# EAGLE board EurocardBackplane (EAGLE 6.6.0)
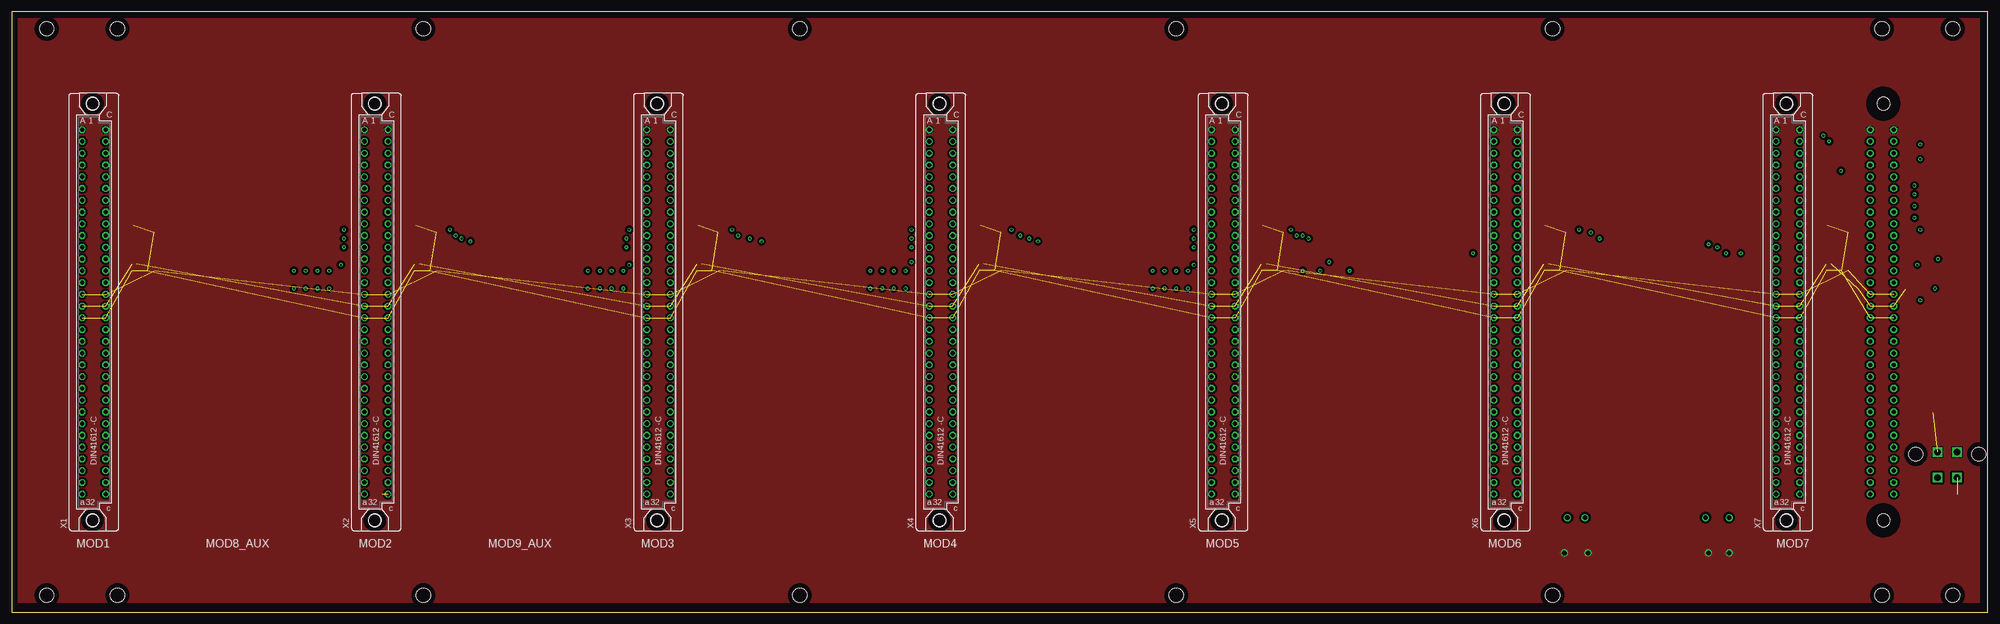
[diagram p8: board, top side]
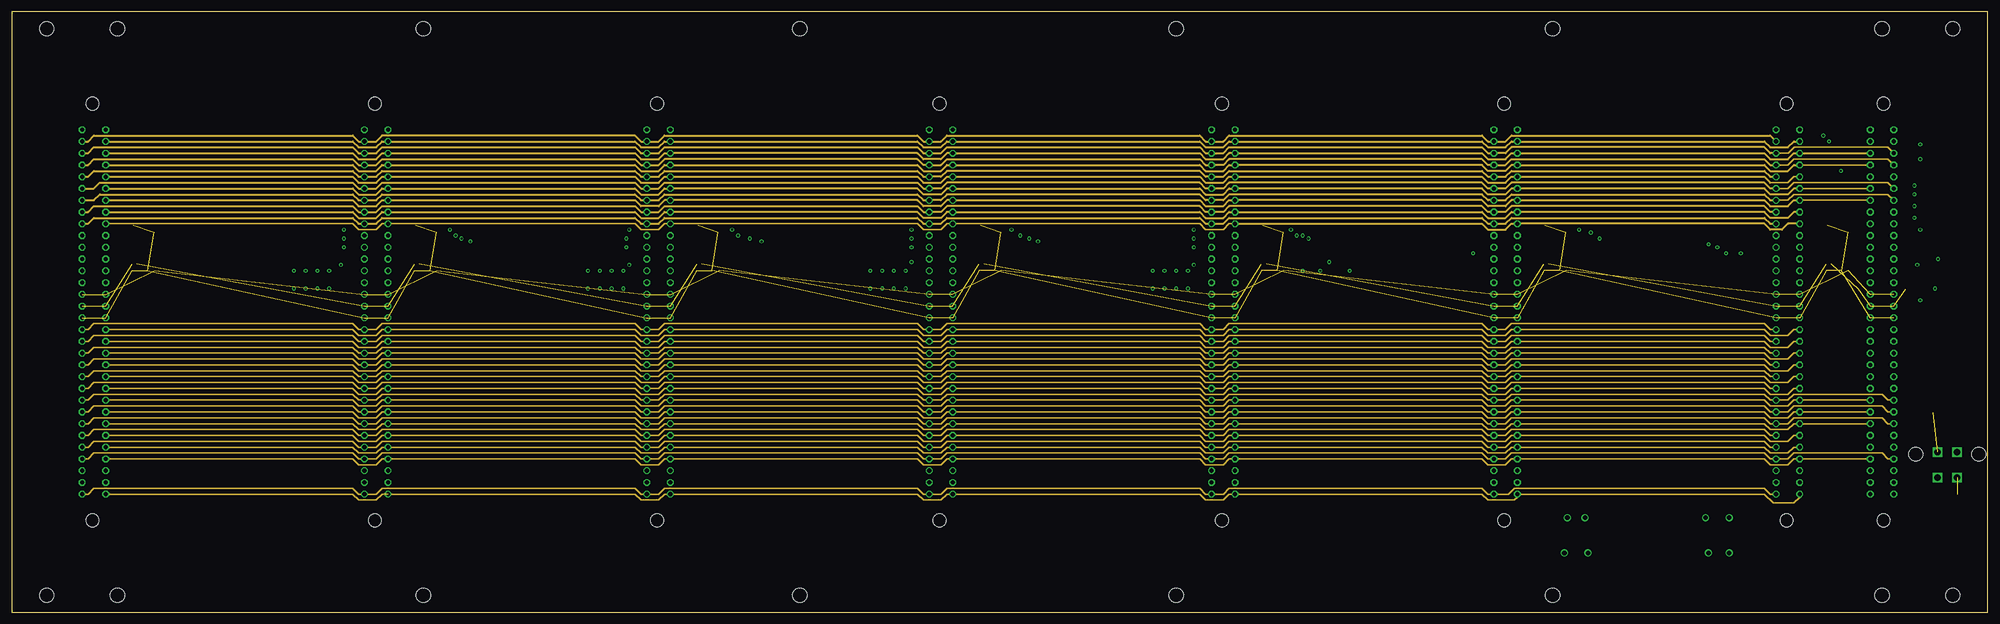
[diagram p9: board, inner layer Route2]
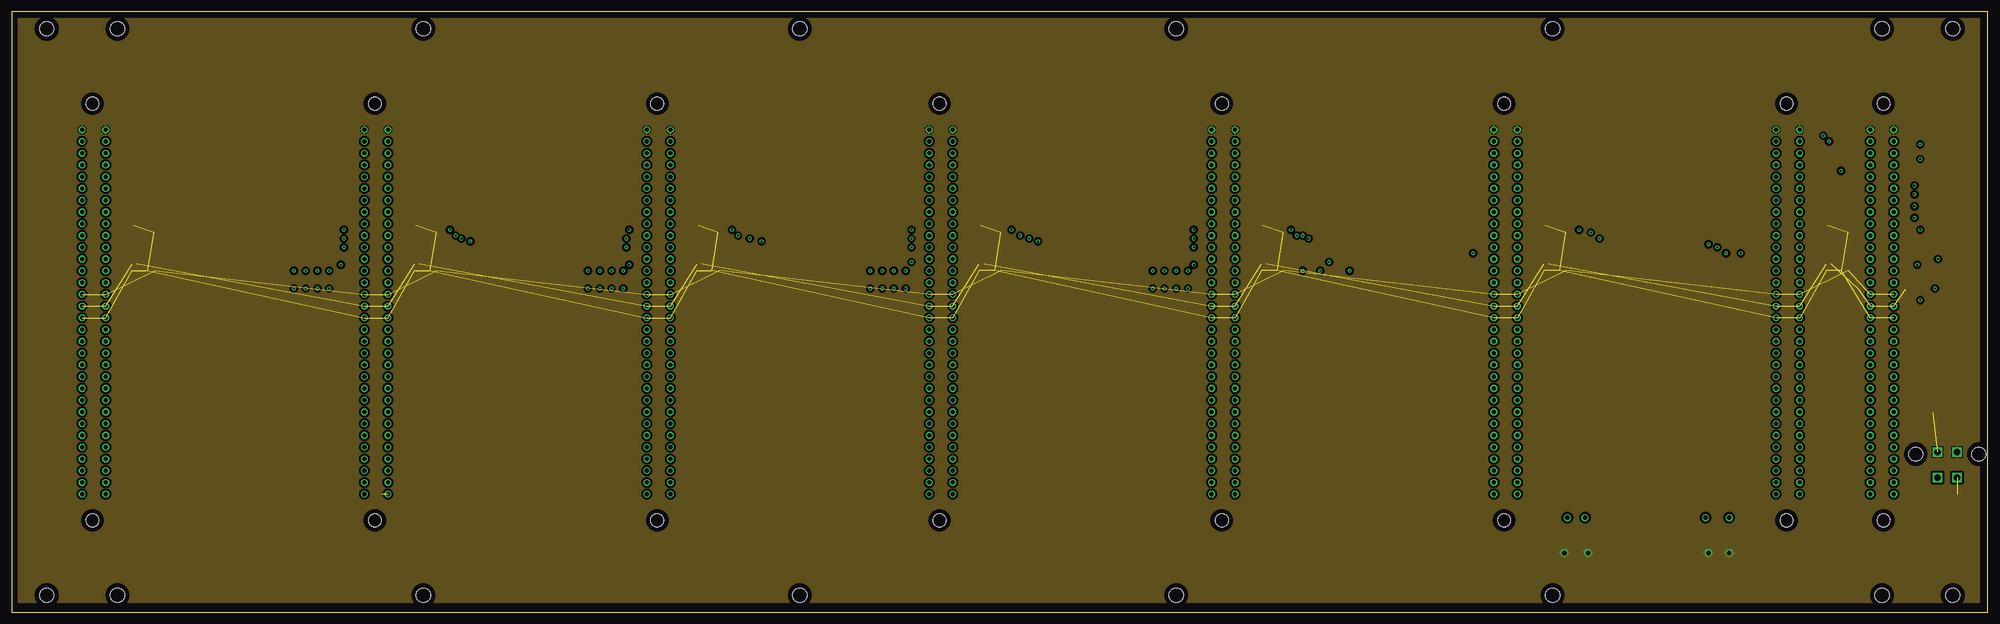
[diagram p10: board, inner layer Route3]
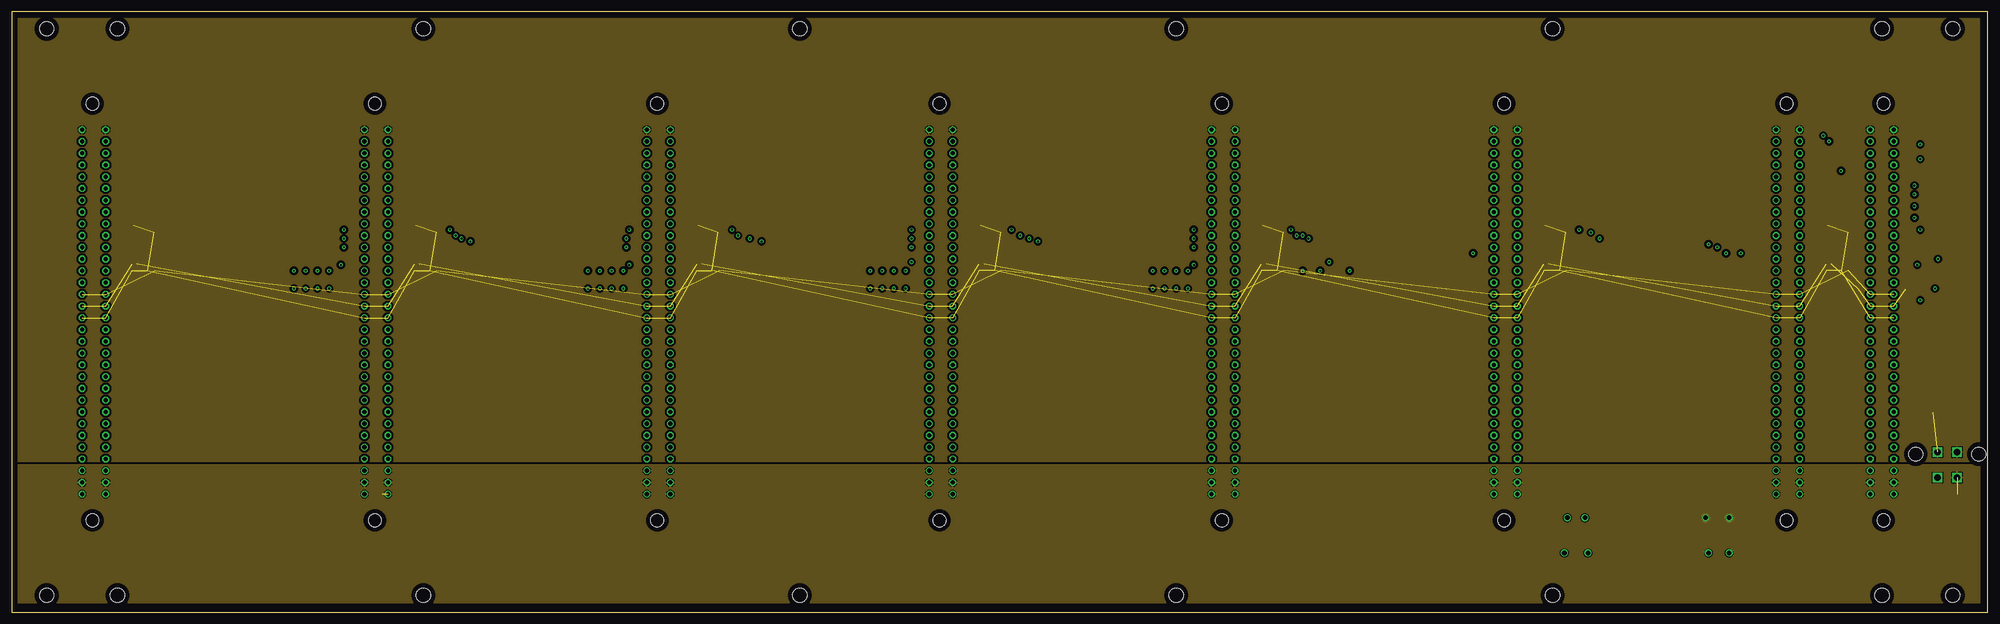
[diagram p11: board, inner layer Route14]
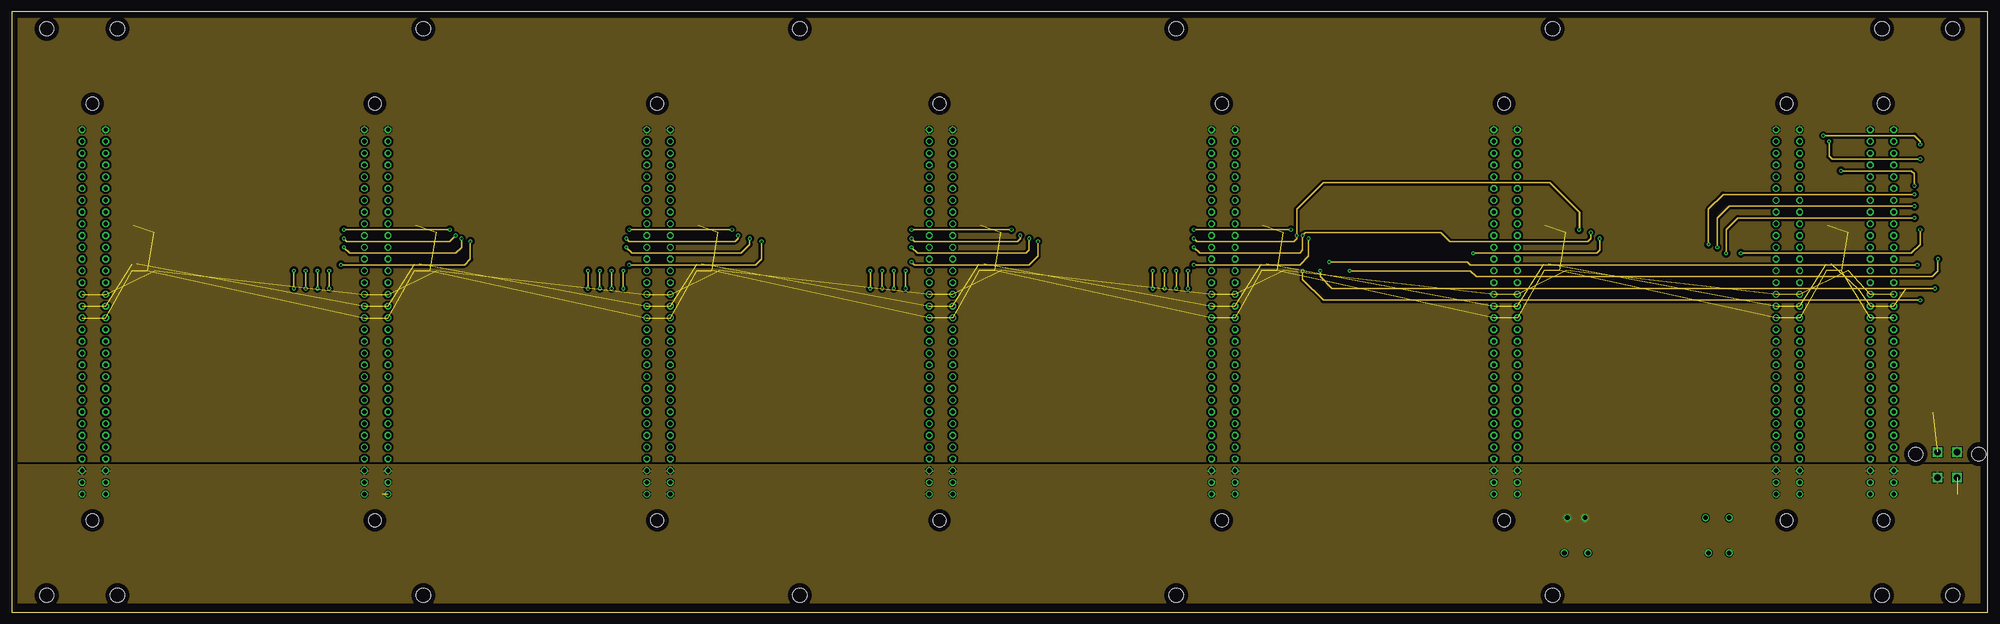
[diagram p12: board, inner layer Route15]
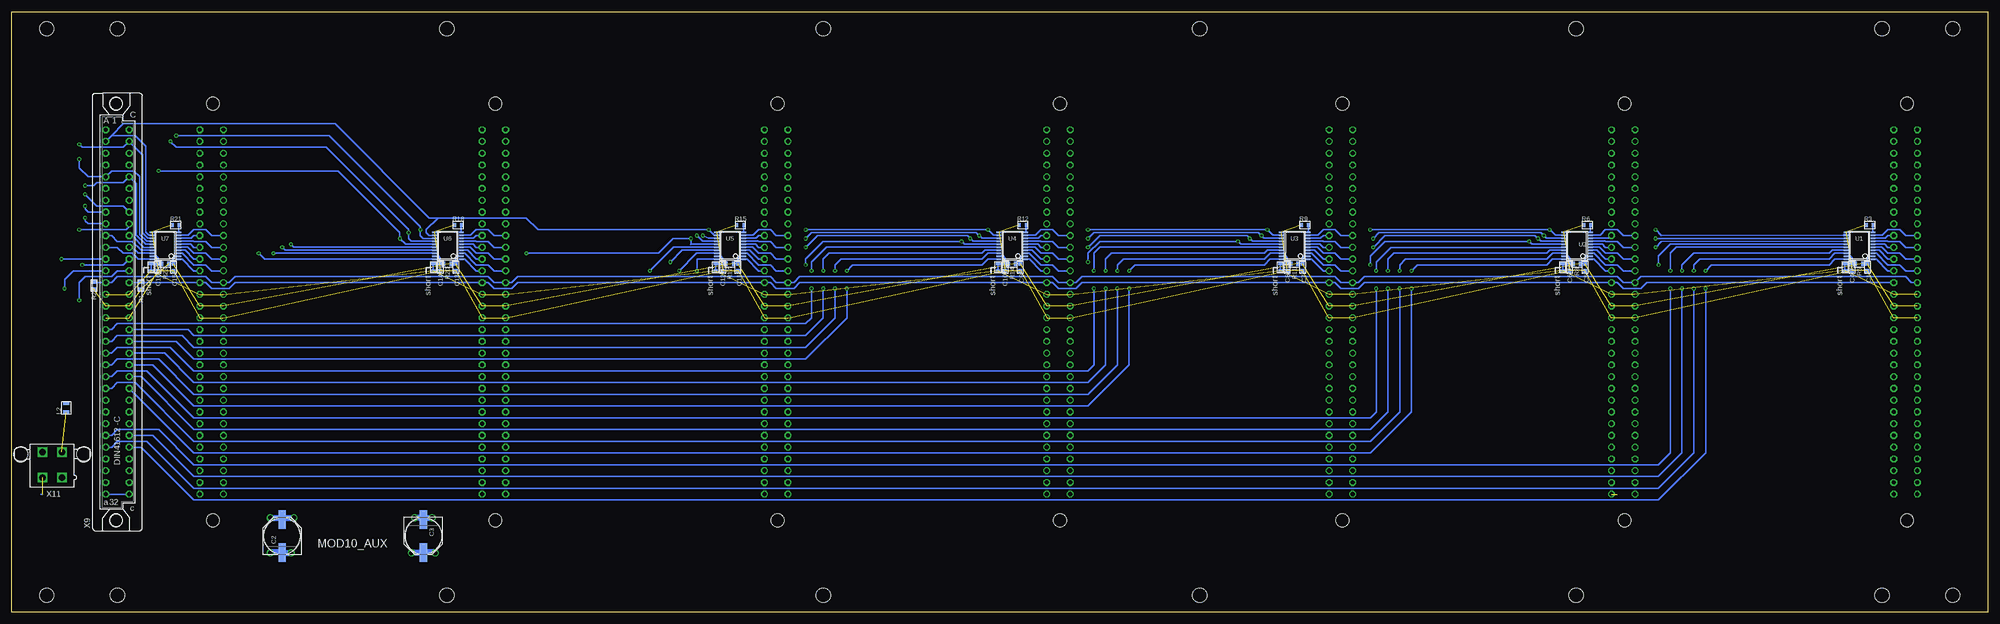
[diagram p13: board, bottom side, seen from below]

Size 426.72 x 129.79 mm. Coordinates in mm from the lower left corner, seen from the top.
Copper layers (1*2*3*14*15*16): Top 0.035mm / dielectric 1.5mm / Route2 0.035mm / dielectric 0.15mm / Route3 0.035mm / dielectric 0.2mm / Route14 0.035mm / dielectric 0.15mm / Route15 0.035mm / dielectric 0.2mm / Bottom 0.035mm
Design rules "default *": minimum track width 10mil, minimum drill 15mil, track to track 8mil, track to pad 8mil, pad to pad 8mil, via to via 8mil, smd to smd 8mil, copper to edge 40mil, drill to drill 8mil, minimum pad ring 10mil, minimum via ring 8mil, stop-mask expansion 4mil, vias tented up to drill 0mil, thermal gap 10mil

## Footprints (pad centres in the part's own frame; a part is rotated, then mirrored left to right if it is on the bottom)
C_MLCC_0603 = smd 0.8 x 0.8: P$1 -0.75,0; P$2 0.75,0
PANASONIC_F = smd 4 x 1.6: + 3.55,0; - -3.55,0
R_0805 = smd 0.7 x 1.3: P$1 -0.95,0; P$2 0.95,0
R_0603 = smd 0.6 x 0.9: P$1 -0.75,0; P$2 0.75,0
TSSOP20 = smd 0.305 x 0.991: 1 -2.575,-2.728; 2 -1.925,-2.728; 3 -1.275,-2.728; 4 -0.625,-2.728; 5 0.025,-2.728; 6 0.675,-2.728; 7 1.325,-2.728; 8 1.975,-2.728; 9 2.625,-2.728; 10 3.275,-2.728; 11 3.275,3.108; 12 2.625,3.108; 13 1.975,3.108; 14 1.325,3.108; 15 0.675,3.108; 16 0.025,3.108; 17 -0.625,3.108; 18 -1.275,3.108; 19 -1.925,3.108; 20 -2.575,3.108
BACKPLANE = hole 3.099: 7.62,126.111; 22.86,126.111; 88.9,126.111; 170.18,126.111; 251.46,126.111; 332.74,126.111; 419.1,126.111; 403.86,126.111; 7.62,3.683; 22.86,3.683; 88.9,3.683; 170.18,3.683; 251.46,3.683; 332.74,3.683; 419.1,3.683; 403.86,3.683
FAC64S = drill 0.914 octagon: A1 -2.54,39.37; A2 -2.54,36.83; A3 -2.54,34.29; A4 -2.54,31.75; A5 -2.54,29.21; A6 -2.54,26.67; A7 -2.54,24.13; A8 -2.54,21.59; A9 -2.54,19.05; A10 -2.54,16.51; A11 -2.54,13.97; A12 -2.54,11.43; A13 -2.54,8.89; A14 -2.54,6.35; A15 -2.54,3.81; A16 -2.54,1.27; A17 -2.54,-1.27; A18 -2.54,-3.81; A19 -2.54,-6.35; A20 -2.54,-8.89; A21 -2.54,-11.43; A22 -2.54,-13.97; A23 -2.54,-16.51; A24 -2.54,-19.05; A25 -2.54,-21.59; A26 -2.54,-24.13; A27 -2.54,-26.67; A28 -2.54,-29.21; A29 -2.54,-31.75; A30 -2.54,-34.29; A31 -2.54,-36.83; A32 -2.54,-39.37; C1 2.54,39.37; C2 2.54,36.83; C3 2.54,34.29; C4 2.54,31.75; C5 2.54,29.21; C6 2.54,26.67; C7 2.54,24.13; C8 2.54,21.59; C9 2.54,19.05; C10 2.54,16.51; C11 2.54,13.97; C12 2.54,11.43; C13 2.54,8.89; C14 2.54,6.35; C15 2.54,3.81; C16 2.54,1.27; C17 2.54,-1.27; C18 2.54,-3.81; C19 2.54,-6.35; C20 2.54,-8.89; C21 2.54,-11.43; C22 2.54,-13.97; C23 2.54,-16.51; C24 2.54,-19.05; C25 2.54,-21.59; C26 2.54,-24.13; C27 2.54,-26.67; C28 2.54,-29.21; C29 2.54,-31.75; C30 2.54,-34.29; C31 2.54,-36.83; C32 2.54,-39.37 | hole 2.794: -0.305,45.009; -0.305,-45.009
5566-4 = drill 1.4 square: 1 2.1,-2.75; 2 -2.1,-2.75; 3 2.1,2.75; 4 -2.1,2.75 | hole 3: 6.8,2.29; -6.8,2.29

## Placement (x,y rotation side)
C1  [C_MLCC_0603]  26.04,74.55 270 bottom
C2  220uF  [PANASONIC_F]  368.3,16.51 90 bottom
C3  [PANASONIC_F]  337.82,16.51 270 bottom
C4  [C_MLCC_0603]  29.34,74.55 270 bottom
C5  [C_MLCC_0603]  87,74.55 270 bottom
C6  [C_MLCC_0603]  90.3,74.55 270 bottom
C7  [C_MLCC_0603]  147.96,74.55 270 bottom
C8  [C_MLCC_0603]  151.26,74.55 270 bottom
C9  [C_MLCC_0603]  208.91,74.55 270 bottom
C10  [C_MLCC_0603]  212.22,74.55 270 bottom
C11  [C_MLCC_0603]  269.88,74.55 270 bottom
C12  [C_MLCC_0603]  273.18,74.55 270 bottom
C13  [C_MLCC_0603]  330.83,74.55 270 bottom
C14  [C_MLCC_0603]  334.14,74.55 270 bottom
C15  [C_MLCC_0603]  391.8,74.55 270 bottom
C16  [C_MLCC_0603]  395.1,74.55 270 bottom
L2  [R_0805]  414.91,44.2 90 bottom
R1  4k7  [R_0603]  398.78,70.61 270 bottom
R2  4k7  [R_0603]  408.94,70.61 270 bottom
R3  10k  [R_0603]  25.53,83.69 0 bottom
R4  [R_0603]  30.86,74.55 270 bottom
R5  [R_0603]  27.81,75.31 0 bottom
R6  10k  [R_0603]  86.49,83.69 0 bottom
R7  [R_0603]  91.82,74.55 270 bottom
R8  [R_0603]  88.77,75.31 0 bottom
R9  10k  [R_0603]  147.45,83.69 0 bottom
R10  [R_0603]  152.78,74.55 270 bottom
R11  [R_0603]  149.73,75.31 0 bottom
R12  10k  [R_0603]  208.41,83.69 0 bottom
R13  [R_0603]  213.74,74.55 270 bottom
R14  [R_0603]  210.69,75.31 0 bottom
R15  10k  [R_0603]  269.37,83.69 0 bottom
R16  [R_0603]  274.7,74.55 270 bottom
R17  [R_0603]  271.65,75.31 0 bottom
R18  10k  [R_0603]  330.33,83.69 0 bottom
R19  [R_0603]  335.66,74.55 270 bottom
R20  [R_0603]  332.61,75.31 0 bottom
R21  10k  [R_0603]  391.29,83.69 0 bottom
R22  [R_0603]  396.62,74.55 270 bottom
R23  [R_0603]  393.57,75.31 0 bottom
U1  TXB0108  [TSSOP20]  27.56,78.87 90 bottom
U2  TXB0108  [TSSOP20]  88.52,78.87 90 bottom
U3  TXB0108  [TSSOP20]  149.48,78.87 90 bottom
U4  TXB0108  [TSSOP20]  210.44,78.87 90 bottom
U5  TXB0108  [TSSOP20]  271.4,78.87 90 bottom
U6  TXB0108  [TSSOP20]  332.36,78.87 90 bottom
U7  TXB0108  [TSSOP20]  393.32,78.87 90 bottom
U$1  [JQI_LOGO_NEGATIVE-SILKSCREEN]  322.58,137.16 0 top  (outside the outline)
U$3  [BACKPLANE]  0,0 0 top
U$4  [JQI_LOGO_NEGATIVE-SILKSCREEN]  353.06,137.16 0 bottom  (outside the outline)
X1  FAC64S  [FAC64S]  17.78,64.9 0 top
X2  FAC64S  [FAC64S]  78.74,64.9 0 top
X3  FAC64S  [FAC64S]  139.7,64.9 0 top
X4  FAC64S  [FAC64S]  200.66,64.9 0 top
X5  FAC64S  [FAC64S]  261.62,64.9 0 top
X6  FAC64S  [FAC64S]  322.58,64.9 0 top
X7  FAC64S  [FAC64S]  383.54,64.9 0 top
X9  FAC64S  [FAC64S]  403.86,64.9 0 bottom
X11  [5566-4]  417.96,31.88 0 bottom

## Tracks (layer width: path | path; a pad name or v marks a point on that pad's centre or on a via)
3V3  (24 unrouted)
  Bottom 0.305: U1.2 25.67,76.94 26.04,76.58 C1.P$1 26.05,75.31 R5.P$2 | U2.2 86.63,76.94 87,76.58 C5.P$1 87.01,75.31 R8.P$2 | U3.2 147.59,76.94 147.96,76.58 C7.P$1 147.97,75.31 R11.P$2 | U4.2 208.55,76.94 208.91,76.58 C9.P$1 208.93,75.31 R14.P$2 | U5.2 269.51,76.94 269.88,76.58 C11.P$1 269.89,75.31 R17.P$2 | U6.2 330.47,76.94 330.83,76.58 C13.P$1 330.85,75.31 R20.P$2 | U7.2 391.43,76.94 391.8,76.58 C15.P$1 391.81,75.31 R23.P$2
5V  (22 unrouted)
  Bottom 0.305: R4.P$2 30.86,75.31 | R10.P$2 152.78,75.31 | R13.P$2 213.74,75.31 | R16.P$2 274.7,75.31 | R19.P$2 335.66,75.31 | R22.P$2 396.62,75.31
+15V  (via drill 1)  (1 unrouted)
  Bottom 0.305: 420.37,25.53 420.06,25.53
  Bottom 1.27: C2.+ 367.91,20.45 v365.76,20.45 | v370.84,20.45 368.3,20.45
  pour Route14: 424.18,31.88 424.81,31.88 424.81,2.03 1.27,2.03 1.27,31.88
-15V  (via drill 1)
  Bottom 1.27: v339.73,20.45 338.21,20.45 arc90 C3.- 337.43,20.45 v335.92,20.45
  pour Route15: 424.18,31.88 424.81,31.88 424.81,2.03 1.27,2.03 1.27,31.88
A2
  Route2 0.406: X1.A2 16.51,101.73 17.78,103 73.66,103 74.93,101.73 X2.A2 78.74,101.73 80.01,103 134.62,103 135.89,101.73 X3.A2 139.7,101.73 140.97,103 195.58,103 196.85,101.73 X4.A2 200.66,101.73 201.93,103 256.54,103 257.81,101.73 X5.A2 261.62,101.73 262.89,103 317.5,103 318.77,101.73 X6.A2 322.58,101.73 323.85,103 379.73,103 X7.A2
A3
  Route2 0.305: X7.A3 383.67,99.19 384.94,100.46 405.13,100.46 X9.A3
  Route2 0.406: X1.A3 16.51,99.19 17.78,100.46 73.66,100.46 74.93,99.19 X2.A3 78.74,99.19 80.01,100.46 134.62,100.46 135.89,99.19 X3.A3 139.7,99.19 140.97,100.46 195.58,100.46 196.85,99.19 X4.A3 200.66,99.19 201.93,100.46 256.54,100.46 257.81,99.19 X5.A3 261.62,99.19 262.89,100.46 317.5,100.46 318.77,99.19 X6.A3 322.58,99.19 323.85,100.46 378.46,100.46 379.73,99.19 X7.A3
A4
  Route2 0.305: X7.A4 383.54,96.65 384.81,97.92 405.13,97.92 X9.A4
  Route2 0.406: X1.A4 16.51,96.65 17.78,97.92 73.66,97.92 74.93,96.65 X2.A4 78.74,96.65 80.01,97.92 134.62,97.92 135.89,96.65 X3.A4 139.7,96.65 140.97,97.92 195.58,97.92 196.85,96.65 X4.A4 200.66,96.65 201.93,97.92 256.54,97.92 257.81,96.65 X5.A4 261.62,96.65 262.89,97.92 317.5,97.92 318.77,96.65 X6.A4 322.58,96.65 323.85,97.92 378.46,97.92 379.73,96.65 X7.A4
A5
  Route2 0.406: X1.A5 16.51,94.11 17.78,95.38 73.66,95.38 74.93,94.11 X2.A5 78.74,94.11 80.01,95.38 134.62,95.38 135.89,94.11 X3.A5 139.7,94.11 140.97,95.38 195.58,95.38 196.85,94.11 X4.A5 200.66,94.11 201.93,95.38 256.54,95.38 257.81,94.11 X5.A5 261.62,94.11 262.89,95.38 317.5,95.38 318.77,94.11 X6.A5 322.58,94.11 323.85,95.38 378.46,95.38 379.73,94.11 X7.A5
A6
  Route2 0.305: X7.A6 383.54,91.57 384.81,92.84 405.13,92.84 X9.A6
  Route2 0.406: X1.A6 17.78,91.57 19.05,92.84 73.66,92.84 74.93,91.57 X2.A6 78.74,91.57 80.01,92.84 134.62,92.84 135.89,91.57 X3.A6 139.7,91.57 140.97,92.84 195.58,92.84 196.85,91.57 X4.A6 200.66,91.57 201.93,92.84 256.54,92.84 257.81,91.57 X5.A6 261.62,91.57 262.89,92.84 317.5,92.84 318.77,91.57 X6.A6 322.58,91.57 323.85,92.84 378.46,92.84 379.73,91.57 X7.A6
A7
  Route2 0.305: X7.A7 383.54,89.03 384.81,90.3 405.13,90.3 X9.A7
  Route2 0.406: X1.A7 17.78,89.03 19.05,90.3 73.66,90.3 74.93,89.03 X2.A7 78.74,89.03 80.01,90.3 134.62,90.3 135.89,89.03 X3.A7 139.7,89.03 140.97,90.3 195.58,90.3 196.85,89.03 X4.A7 200.66,89.03 201.93,90.3 256.54,90.3 257.81,89.03 X5.A7 261.62,89.03 262.89,90.3 317.5,90.3 318.77,89.03 X6.A7 322.58,89.03 323.85,90.3 378.46,90.3 379.73,89.03 X7.A7
A8
  Route2 0.406: X1.A8 16.51,86.49 17.78,87.76 73.66,87.76 74.93,86.49 X2.A8 78.74,86.49 80.01,87.76 134.62,87.76 135.89,86.49 X3.A8 139.7,86.49 140.97,87.76 195.58,87.76 196.85,86.49 X4.A8 200.66,86.49 201.93,87.76 256.54,87.76 257.81,86.49 X5.A8 261.62,86.49 262.89,87.76 317.5,87.76 318.77,86.49 X6.A8 322.58,86.49 323.85,87.76 378.46,87.76 379.73,86.49 X7.A8
A9
  Route2 0.406: X1.A9 16.51,83.95 17.78,85.22 73.66,85.22 74.93,83.95 X2.A9 78.74,83.95 80.01,85.22 134.62,85.22 135.89,83.95 X3.A9 139.7,83.95 140.97,85.22 195.58,85.22 196.85,83.95 X4.A9 200.66,83.95 201.93,85.22 256.54,85.22 257.81,83.95 X5.A9 261.62,83.95 262.89,85.22 317.5,85.22 318.77,83.95 X6.A9 322.58,83.95 323.85,85.22 378.46,85.22 379.73,83.95 X7.A9
A10  (via drill 0.38)
  Route15 0.305: v71.75,82.68 v94.61,82.68 | v133.35,82.68 v155.57,82.68 | v194.31,82.68 v215.9,82.68 | v255.27,82.68 v276.23,82.68
  Bottom 0.305: U7.12 397.09,81.49 397.76,82.17 397.76,100.71 400.05,103 405.13,103 | 31.2,81.49 70.48,81.41 v71.75,82.68 | v133.35,82.68 v94.61,82.68 93.43,81.49 U2.12 | v194.31,82.68 v155.57,82.68 154.39,81.49 U3.12 | v255.27,82.68 v215.9,82.68 214.72,81.49 U4.12 | U5.12 275.04,81.49 v276.23,82.68 313.06,82.68 315.6,85.22 334.64,85.22 | 405.13,103 402.59,105.54 356.87,105.54 336.55,85.22 334.64,85.22 | 405.13,103 X9.A2 | 334.64,85.22 337.19,82.68 337.19,82.04 336.55,81.41 335.55,81.41 U6.12
  Bottom 0.406: U1.12 31.2,81.49
A11  (via drill 0.38)
  Route15 0.305: v71.75,78.87 73.03,77.6 95.89,77.6 97.16,78.87 v97.16,80.77 | v132.72,78.87 133.99,77.6 157.48,77.6 159.38,79.5 v159.38,80.77 | v194.31,78.87 195.58,77.6 219.07,77.6 219.71,78.23 v219.71,80.77 | v255.27,78.87 256.54,77.6 278.13,77.6 278.76,78.23 v278.76,81.41 279.4,82.04 308.61,82.04 310.51,80.14 340.36,80.14 341,80.77 v341,82.04 | v412.12,97.92 393.06,97.92 392.43,98.55 v392.43,101.73
  Bottom 0.305: U7.14 397.56,80.19 399.03,81.66 399.03,94.11 400.3,95.38 405.13,95.38 X9.A5 410.21,94.11 412.12,96.01 v412.12,97.92 | U1.14 70.48,80.14 v71.75,78.87 | v132.72,78.87 130.18,81.41 97.79,81.41 v97.16,80.77 96.58,80.19 U2.14 | v194.31,78.87 191.77,81.41 160.02,81.41 v159.38,80.77 158.81,80.19 U3.14 | U4.14 219.13,80.19 v219.71,80.77 220.34,81.41 252.73,81.41 v255.27,78.87 | U5.14 277.55,80.19 v278.76,81.41 | U6.14 340.42,80.19 341,80.77 v341,82.04 341,82.68 358.77,100.46 391.16,100.46 v392.43,101.73
  Bottom 0.406: U6.14 335.47,80.14
A14
  Bottom 0.305: X1.A14 16.51,71.25 17.78,72.52 74.93,72.52 X2.A14 78.74,71.25 80.01,72.52 134.62,72.52 135.89,71.25 X3.A14 139.7,71.25 140.97,72.52 195.58,72.52 196.85,71.25 X4.A14 200.66,71.25 201.93,72.52 256.54,72.52 257.81,71.25 X5.A14 261.62,71.25 262.89,72.52 317.5,72.52 318.77,71.25 X6.A14 322.58,71.25 323.85,72.52 378.46,72.52 379.73,71.25 X7.A14 383.54,71.25 384.81,72.52 403.86,72.52 405.13,71.25 X9.A14 408.31,71.25 arc21 R2.P$1
A18
  Route2 0.305: X1.A18 16.51,61.09 17.78,62.36 73.66,62.36 74.93,61.09 X2.A18 78.74,61.09 80.01,62.36 134.62,62.36 135.89,61.09 X3.A18 139.7,61.09 140.97,62.36 195.58,62.36 196.85,61.09 X4.A18 200.66,61.09 201.93,62.36 256.54,62.36 257.81,61.09 X5.A18 261.62,61.09 262.89,62.36 317.5,62.36 318.77,61.09 X6.A18 322.58,61.09 323.85,62.36 378.46,62.36 379.73,61.09 X7.A18
A19
  Route2 0.305: X1.A19 16.51,58.55 17.78,59.82 73.66,59.82 74.93,58.55 X2.A19 78.74,58.55 80.01,59.82 134.62,59.82 135.89,58.55 X3.A19 139.7,58.55 140.97,59.82 195.58,59.82 196.85,58.55 X4.A19 200.66,58.55 201.93,59.82 256.54,59.82 257.81,58.55 X5.A19 261.62,58.55 262.89,59.82 317.5,59.82 318.77,58.55 X6.A19 322.58,58.55 323.85,59.82 378.46,59.82 379.73,58.55 X7.A19
A20
  Route2 0.305: X1.A20 16.51,56.01 17.78,57.28 73.66,57.28 74.93,56.01 X2.A20 78.74,56.01 80.01,57.28 134.62,57.28 135.89,56.01 X3.A20 139.7,56.01 140.97,57.28 195.58,57.28 196.85,56.01 X4.A20 200.66,56.01 201.93,57.28 256.54,57.28 257.81,56.01 X5.A20 261.62,56.01 262.89,57.28 317.5,57.28 318.77,56.01 X6.A20 322.58,56.01 323.85,57.28 378.46,57.28 379.73,56.01 X7.A20
A21
  Route2 0.305: X1.A21 16.51,53.47 17.78,54.74 73.66,54.74 74.93,53.47 X2.A21 78.74,53.47 80.01,54.74 134.62,54.74 135.89,53.47 X3.A21 139.7,53.47 140.97,54.74 195.58,54.74 196.85,53.47 X4.A21 200.66,53.47 201.93,54.74 256.54,54.74 257.81,53.47 X5.A21 261.62,53.47 262.89,54.74 317.5,54.74 318.77,53.47 X6.A21 322.58,53.47 323.85,54.74 378.46,54.74 379.73,53.47 X7.A21
A22
  Route2 0.305: X1.A22 16.51,50.93 17.78,52.2 73.66,52.2 74.93,50.93 X2.A22 78.74,50.93 80.01,52.2 134.62,52.2 135.89,50.93 X3.A22 139.7,50.93 140.97,52.2 195.58,52.2 196.85,50.93 X4.A22 200.66,50.93 201.93,52.2 256.54,52.2 257.81,50.93 X5.A22 261.62,50.93 262.89,52.2 317.5,52.2 318.77,50.93 X6.A22 322.58,50.93 323.85,52.2 378.46,52.2 379.73,50.93 X7.A22
A23
  Route2 0.305: X1.A23 16.51,48.39 17.78,49.66 73.66,49.66 74.93,48.39 X2.A23 78.74,48.39 80.01,49.66 134.62,49.66 135.89,48.39 X3.A23 139.7,48.39 140.97,49.66 195.58,49.66 196.85,48.39 X4.A23 200.66,48.39 201.93,49.66 256.54,49.66 257.81,48.39 X5.A23 261.62,48.39 262.89,49.66 317.5,49.66 318.77,48.39 X6.A23 322.58,48.39 323.85,49.66 378.46,49.66 379.73,48.39 X7.A23
A24
  Route2 0.305: X1.A24 16.51,45.85 17.78,47.12 73.66,47.12 74.93,45.85 X2.A24 78.74,45.85 80.01,47.12 134.62,47.12 135.89,45.85 X3.A24 139.7,45.85 140.97,47.12 195.58,47.12 196.85,45.85 X4.A24 200.66,45.85 201.93,47.12 256.54,47.12 257.81,45.85 X5.A24 261.62,45.85 262.89,47.12 317.5,47.12 318.77,45.85 X6.A24 322.58,45.85 323.85,47.12 378.46,47.12 379.73,45.85 X7.A24 383.54,45.85 384.81,47.12 403.86,47.12 405.13,45.85 X9.A24
A25
  Route2 0.305: X1.A25 16.51,43.31 17.78,44.58 73.66,44.58 74.93,43.31 X2.A25 78.74,43.31 80.01,44.58 134.62,44.58 135.89,43.31 X3.A25 139.7,43.31 140.97,44.58 195.58,44.58 196.85,43.31 X4.A25 200.66,43.31 201.93,44.58 256.54,44.58 257.81,43.31 X5.A25 261.62,43.31 262.89,44.58 317.5,44.58 318.77,43.31 X6.A25 322.58,43.31 323.85,44.58 378.46,44.58 379.73,43.31 X7.A25 383.54,43.31 384.81,44.58 403.86,44.58 405.13,43.31 X9.A25
A26
  Route2 0.305: X1.A26 16.51,40.77 17.78,42.04 73.66,42.04 74.93,40.77 X2.A26 78.74,40.77 80.01,42.04 134.62,42.04 135.89,40.77 X3.A26 139.7,40.77 140.97,42.04 195.58,42.04 196.85,40.77 X4.A26 200.66,40.77 201.93,42.04 256.54,42.04 257.81,40.77 X5.A26 261.62,40.77 262.89,42.04 317.5,42.04 318.77,40.77 X6.A26 322.58,40.77 323.85,42.04 378.46,42.04 379.73,40.77 X7.A26 383.54,40.77 384.81,42.04 403.86,42.04 405.13,40.77 X9.A26
A27
  Route2 0.305: X1.A27 16.51,38.23 17.78,39.5 73.66,39.5 74.93,38.23 X2.A27 78.74,38.23 80.01,39.5 134.62,39.5 135.89,38.23 X3.A27 139.7,38.23 140.97,39.5 195.58,39.5 196.85,38.23 X4.A27 200.66,38.23 201.93,39.5 256.54,39.5 257.81,38.23 X5.A27 261.62,38.23 262.89,39.5 317.5,39.5 318.77,38.23 X6.A27 322.58,38.23 323.85,39.5 378.46,39.5 379.73,38.23 X7.A27
A28
  Route2 0.305: X1.A28 16.51,35.69 17.78,36.96 73.66,36.96 74.93,35.69 X2.A28 78.74,35.69 80.01,36.96 134.62,36.96 135.89,35.69 X3.A28 139.7,35.69 140.97,36.96 195.58,36.96 196.85,35.69 X4.A28 200.66,35.69 201.93,36.96 256.54,36.96 257.81,35.69 X5.A28 261.62,35.69 262.89,36.96 317.5,36.96 318.77,35.69 X6.A28 322.58,35.69 323.85,36.96 378.46,36.96 379.73,35.69 X7.A28
A29
  Route2 0.305: X1.A29 16.51,33.15 17.78,34.42 73.66,34.42 74.93,33.15 X2.A29 78.74,33.15 80.01,34.42 134.62,34.42 135.89,33.15 X3.A29 139.7,33.15 140.97,34.42 195.58,34.42 196.85,33.15 X4.A29 200.66,33.15 201.93,34.42 256.54,34.42 257.81,33.15 X5.A29 261.62,33.15 262.89,34.42 317.5,34.42 318.77,33.15 X6.A29 322.58,33.15 323.85,34.42 378.46,34.42 379.73,33.15 X7.A29 383.54,33.15 384.81,34.42 403.86,34.42 405.13,33.15 X9.A29
A32
  Route2 0.305: X1.A32 16.51,25.53 17.78,26.8 73.66,26.8 74.93,25.53 X2.A32 78.74,25.53 80.01,26.8 134.62,26.8 135.89,25.53 X3.A32 139.7,25.53 140.97,26.8 195.58,26.8 196.85,25.53 X4.A32 200.66,25.53 201.93,26.8 256.54,26.8 257.81,25.53 X5.A32 261.62,25.53 262.89,26.8 317.5,26.8 318.77,25.53 X6.A32 323.21,25.53 324.49,26.8 378.46,26.8 379.73,25.53 X7.A32
C2
  Route2 0.406: X1.C2 73.66,101.73 74.93,100.46 78.74,100.46 80.01,101.73 X2.C2 134.62,101.73 135.89,100.46 139.7,100.46 140.97,101.73 X3.C2 195.58,101.73 196.85,100.46 200.66,100.46 201.93,101.73 X4.C2 256.54,101.73 257.81,100.46 261.62,100.46 262.89,101.73 X5.C2 317.5,101.73 318.77,100.46 322.58,100.46 323.85,101.73 X6.C2 378.46,101.73 379.73,100.46 383.54,100.46 384.81,101.73 X7.C2
C3
  Route2 0.406: X1.C3 73.66,99.19 74.93,97.92 78.74,97.92 80.01,99.19 X2.C3 134.62,99.19 135.89,97.92 139.7,97.92 140.97,99.19 X3.C3 195.58,99.19 196.85,97.92 200.66,97.92 201.93,99.19 X4.C3 256.54,99.19 257.81,97.92 261.62,97.92 262.89,99.19 X5.C3 317.5,99.19 318.77,97.92 322.58,97.92 323.85,99.19 X6.C3 378.46,99.19 379.73,97.92 383.54,97.92 384.81,99.19 X7.C3 X9.C3
C4
  Route2 0.305: X7.C4 X9.C4
  Route2 0.406: X1.C4 73.66,96.65 74.93,95.38 78.74,95.38 80.01,96.65 X2.C4 134.62,96.65 135.89,95.38 139.7,95.38 140.97,96.65 X3.C4 195.58,96.65 196.85,95.38 200.66,95.38 201.93,96.65 X4.C4 256.54,96.65 257.81,95.38 261.62,95.38 262.89,96.65 X5.C4 317.5,96.65 318.77,95.38 322.58,95.38 323.85,96.65 X6.C4 378.46,96.65 379.73,95.38 383.54,95.38 384.81,96.65 X7.C4
C5
  Route2 0.305: 379.73,92.84 383.54,92.84 384.81,94.11 X7.C5
  Route2 0.406: X1.C5 73.66,94.11 74.93,92.84 78.74,92.84 80.01,94.11 X2.C5 134.62,94.11 135.89,92.84 139.7,92.84 140.97,94.11 X3.C5 195.58,94.11 196.85,92.84 200.66,92.84 201.93,94.11 X4.C5 256.54,94.11 257.81,92.84 261.62,92.84 262.89,94.11 X5.C5 317.5,94.11 318.77,92.84 322.58,92.84 323.85,94.11 X6.C5 378.46,94.11 379.73,92.84
C6
  Route2 0.305: X7.C6 X9.C6
  Route2 0.406: X1.C6 73.66,91.57 74.93,90.3 78.74,90.3 80.01,91.57 X2.C6 134.62,91.57 135.89,90.3 139.7,90.3 140.97,91.57 X3.C6 195.58,91.57 196.85,90.3 200.66,90.3 201.93,91.57 X4.C6 256.54,91.57 257.81,90.3 261.62,90.3 262.89,91.57 X5.C6 317.5,91.57 318.77,90.3 322.58,90.3 323.85,91.57 X6.C6 378.46,91.57 379.73,90.3 383.54,90.3 384.81,91.57 X7.C6
C7
  Route2 0.305: X7.C7 X9.C7
  Route2 0.406: X1.C7 73.66,89.03 74.93,87.76 78.74,87.76 80.01,89.03 X2.C7 134.62,89.03 135.89,87.76 139.7,87.76 140.97,89.03 X3.C7 195.58,89.03 196.85,87.76 200.66,87.76 201.93,89.03 X4.C7 256.54,89.03 257.81,87.76 261.62,87.76 262.89,89.03 X5.C7 317.5,89.03 318.77,87.76 322.58,87.76 323.85,89.03 X6.C7 378.46,89.03 379.73,87.76 383.54,87.76 384.81,89.03 X7.C7
C8
  Route2 0.406: X1.C8 73.66,86.49 74.93,85.22 78.74,85.22 80.01,86.49 X2.C8 134.62,86.49 135.89,85.22 139.7,85.22 140.97,86.49 X3.C8 195.58,86.49 196.85,85.22 200.66,85.22 201.93,86.49 X4.C8 256.54,86.49 257.81,85.22 261.62,85.22 262.89,86.49 X5.C8 317.5,86.49 318.77,85.22 322.58,85.22 323.85,86.49 X6.C8 378.46,86.49 379.73,85.22 383.54,85.22 384.81,86.49 X7.C8
C9
  Route2 0.305: X1.C9 73.66,83.95 74.93,82.68 78.74,82.68 80.01,83.95 X2.C9 134.62,83.95 135.89,82.68 139.7,82.68 140.97,83.95 X3.C9 195.58,83.95 196.85,82.68 200.66,82.68 201.93,83.95 X4.C9 256.54,83.95 257.81,82.68 261.62,82.68 262.89,83.95 X5.C9
  Route2 0.406: X5.C9 317.5,83.95 318.77,82.68 322.58,82.68 323.85,83.95 X6.C9 378.46,83.95 379.73,82.68 382.27,82.68 383.54,83.95 X7.C9
C10  (via drill 0.38)
  Route15 0.305: v71.75,80.77 72.39,80.14 94.61,80.14 v95.89,81.41 | v132.72,80.77 133.35,80.14 156.21,80.14 156.84,80.77 v156.84,81.41 | v194.31,80.77 194.94,80.14 217.17,80.14 217.81,80.77 v217.81,81.41 | v255.27,80.77 255.91,80.14 276.86,80.14 277.5,80.77 v277.5,81.41 277.5,87.12 283.21,92.84 332.11,92.84 338.45,86.49 | v391.16,103 410.85,103 412.12,101.73 v412.12,101.09
  Route15 0.406: 338.45,86.49 v338.45,82.68
  Bottom 0.305: U7.13 397.33,80.84 398.4,81.91 398.4,98.81 X9.C2 402.59,100.46 411.48,100.46 v412.12,101.09 | U1.13 30.67,80.77 v71.75,80.77 | v194.31,80.77 193.04,82.04 157.48,82.04 v156.84,81.41 156.28,80.84 U3.13 | U2.13 95.32,80.84 v95.89,81.41 96.52,82.04 131.44,82.04 v132.72,80.77 | U4.13 217.24,80.84 v217.81,81.41 218.44,82.04 254,82.04 v255.27,80.77 | U5.13 276.3,80.84 v277.5,81.41 | v391.16,103 358.14,103 338.45,83.31 v338.45,82.68 338.45,81.41 337.82,80.77 335.54,80.77 arc-90 U6.13
C11  (via drill 0.38)
  Route15 0.305: v194.31,75.69 194.94,75.06 219.71,75.06 221.62,76.96 v221.62,80.14 | v71.12,75.06 97.79,75.06 99.06,76.33 v99.06,80.14 | v133.35,75.06 160.66,75.06 161.93,76.33 v161.93,80.14 | v255.27,75.06 278.13,75.06 280.04,76.96 v280.04,80.77 | v315.6,77.6 342.26,77.6 342.9,78.23 v342.9,80.77 | v394.97,95.38 410.21,95.38 410.85,94.74 v410.85,92.2
  Bottom 0.305: U7.15 397.8,79.54 399.8,81.53 399.8,92.58 X9.C5 402.59,92.84 408.31,92.84 408.94,92.2 v410.85,92.2 | U1.15 68.54,79.54 71.12,76.96 v71.12,75.06 | v133.35,75.06 133.35,76.96 130.18,80.14 v99.06,80.14 98.47,79.54 U2.15 | v194.31,75.69 194.31,77.6 191.77,80.14 v161.93,80.14 161.33,79.54 U3.15 | U5.15 280.04,79.54 v280.04,80.77 283.85,80.77 287.02,77.6 v315.6,77.6 | U4.15 221.02,79.54 v221.62,80.14 251.46,80.14 255.27,76.33 v255.27,75.06 | U6.15 341.67,79.54 v342.9,80.77 342.9,82.04 356.24,95.38 v394.97,95.38
  Bottom 0.406: 280.04,79.54 280.04,79.5
C14
  Bottom 0.305: X1.C14 73.66,71.25 74.93,69.98 78.74,69.98 80.01,71.25 X2.C14 134.62,71.25 135.89,69.98 139.7,69.98 140.97,71.25 X3.C14 195.58,71.25 196.85,69.98 200.66,69.98 201.93,71.25 X4.C14 256.54,71.25 257.81,69.98 261.62,69.98 262.89,71.25 X5.C14 317.5,71.25 318.77,69.98 322.58,69.98 323.85,71.25 X6.C14 378.46,71.25 379.73,69.98 383.54,69.98 384.81,71.25 X7.C14 398.78,71.25 | 398.78,71.25 X9.C14 | R1.P$1 398.78,71.25
C18
  Route2 0.305: X1.C18 73.66,61.09 74.93,59.82 78.74,59.82 80.01,61.09 X2.C18 134.62,61.09 135.89,59.82 139.7,59.82 140.97,61.09 X3.C18 195.58,61.09 196.85,59.82 200.66,59.82 201.93,61.09 X4.C18 256.54,61.09 257.81,59.82 261.62,59.82 262.89,61.09 X5.C18 317.5,61.09 318.77,59.82 322.58,59.82 323.85,61.09 X6.C18 378.46,61.09 379.73,59.82 383.54,59.82 384.81,61.09 X7.C18
C19
  Route2 0.305: X1.C19 73.66,58.55 74.93,57.28 78.74,57.28 80.01,58.55 X2.C19 134.62,58.55 135.89,57.28 139.7,57.28 140.97,58.55 X3.C19 195.58,58.55 196.85,57.28 200.66,57.28 201.93,58.55 X4.C19 256.54,58.55 257.81,57.28 261.62,57.28 262.89,58.55 X5.C19 317.5,58.55 318.77,57.28 322.58,57.28 323.85,58.55 X6.C19 378.46,58.55 379.73,57.28 383.54,57.28 384.81,58.55 X7.C19
C20
  Route2 0.305: X1.C20 73.66,56.01 74.93,54.74 78.74,54.74 80.01,56.01 X2.C20 134.62,56.01 135.89,54.74 139.7,54.74 140.97,56.01 X3.C20 195.58,56.01 196.85,54.74 200.66,54.74 201.93,56.01 X4.C20 256.54,56.01 257.81,54.74 261.62,54.74 262.89,56.01 X5.C20 317.5,56.01 318.77,54.74 322.58,54.74 323.85,56.01 X6.C20 378.46,56.01 379.73,54.74 383.54,54.74 384.81,56.01 X7.C20
C21
  Route2 0.305: X1.C21 73.66,53.47 74.93,52.2 78.74,52.2 80.01,53.47 X2.C21 134.62,53.47 135.89,52.2 139.7,52.2 140.97,53.47 X3.C21 195.58,53.47 196.85,52.2 200.66,52.2 201.93,53.47 X4.C21 256.54,53.47 257.81,52.2 261.62,52.2 262.89,53.47 X5.C21 317.5,53.47 318.77,52.2 322.58,52.2 323.85,53.47 X6.C21 378.46,53.47 379.73,52.2 383.54,52.2 384.81,53.47 X7.C21
C22
  Route2 0.305: X1.C22 73.66,50.93 74.93,49.66 78.74,49.66 80.01,50.93 X2.C22 134.62,50.93 135.89,49.66 139.7,49.66 140.97,50.93 X3.C22 195.58,50.93 196.85,49.66 200.66,49.66 201.93,50.93 X4.C22 256.54,50.93 257.81,49.66 261.62,49.66 262.89,50.93 X5.C22 317.5,50.93 318.77,49.66 322.58,49.66 323.85,50.93 X6.C22 378.46,50.93 379.73,49.66 383.54,49.66 384.81,50.93 X7.C22
C23
  Route2 0.305: X1.C23 73.66,48.39 74.93,47.12 78.74,47.12 80.01,48.39 X2.C23 134.62,48.39 135.89,47.12 139.7,47.12 140.97,48.39 X3.C23 195.58,48.39 196.85,47.12 200.66,47.12 201.93,48.39 X4.C23 256.54,48.39 257.81,47.12 261.62,47.12 262.89,48.39 X5.C23 317.5,48.39 318.77,47.12 322.58,47.12 323.85,48.39 X6.C23 378.46,48.39 379.73,47.12 383.54,47.12 384.81,48.39 X7.C23
C24
  Route2 0.305: X1.C24 73.66,45.85 74.93,44.58 78.74,44.58 80.01,45.85 X2.C24 134.62,45.85 135.89,44.58 139.7,44.58 140.97,45.85 X3.C24 195.58,45.85 196.85,44.58 200.66,44.58 201.93,45.85 X4.C24 256.54,45.85 257.81,44.58 261.62,44.58 262.89,45.85 X5.C24 317.5,45.85 318.77,44.58 322.58,44.58 323.85,45.85 X6.C24 378.46,45.85 379.73,44.58 383.54,44.58 384.81,45.85 X7.C24 X9.C24
C25
  Route2 0.305: X1.C25 73.66,43.31 74.93,42.04 78.74,42.04 80.01,43.31 X2.C25 134.62,43.31 135.89,42.04 139.7,42.04 140.97,43.31 X3.C25 195.58,43.31 196.85,42.04 200.66,42.04 201.93,43.31 X4.C25 256.54,43.31 257.81,42.04 261.62,42.04 262.89,43.31 X5.C25 317.5,43.31 318.77,42.04 322.58,42.04 323.85,43.31 X6.C25 378.46,43.31 379.73,42.04 383.54,42.04 384.81,43.31 X7.C25 X9.C25
C26
  Route2 0.305: X1.C26 73.66,40.77 74.93,39.5 78.74,39.5 80.01,40.77 X2.C26 134.62,40.77 135.89,39.5 139.7,39.5 140.97,40.77 X3.C26 195.58,40.77 196.85,39.5 200.66,39.5 201.93,40.77 X4.C26 256.54,40.77 257.81,39.5 261.62,39.5 262.89,40.77 X5.C26 317.5,40.77 318.77,39.5 322.58,39.5 323.85,40.77 X6.C26 378.46,40.77 379.73,39.5 383.54,39.5 384.81,40.77 X7.C26 X9.C26
C27
  Route2 0.305: X1.C27 73.66,38.23 74.93,36.96 78.74,36.96 80.01,38.23 X2.C27 134.62,38.23 135.89,36.96 139.7,36.96 140.97,38.23 X3.C27 195.58,38.23 196.85,36.96 200.66,36.96 201.93,38.23 X4.C27 256.54,38.23 257.81,36.96 261.62,36.96 262.89,38.23 X5.C27 317.5,38.23 318.77,36.96 322.58,36.96 323.85,38.23 X6.C27 378.46,38.23 379.73,36.96 383.54,36.96 384.81,38.23 X7.C27
C28
  Route2 0.305: X1.C28 73.66,35.69 74.93,34.42 78.74,34.42 80.01,35.69 X2.C28 134.62,35.69 135.89,34.42 139.7,34.42 140.97,35.69 X3.C28 195.58,35.69 196.85,34.42 200.66,34.42 201.93,35.69 X4.C28 256.54,35.69 257.81,34.42 261.62,34.42 262.89,35.69 X5.C28 317.5,35.69 318.77,34.42 322.58,34.42 323.85,35.69 X6.C28 378.46,35.69 379.73,34.42 383.54,34.42 384.81,35.69 X7.C28
C29
  Route2 0.305: X1.C29 73.66,33.15 74.93,31.88 78.74,31.88 80.01,33.15 X2.C29 134.62,33.15 135.89,31.88 139.7,31.88 140.97,33.15 X3.C29 195.58,33.15 196.85,31.88 200.66,31.88 201.93,33.15 X4.C29 256.54,33.15 257.81,31.88 261.62,31.88 262.89,33.15 X5.C29 317.5,33.15 318.77,31.88 322.58,31.88 323.85,33.15 X6.C29 378.46,33.15 379.73,31.88 383.54,31.88 384.81,33.15 X7.C29 X9.C29
C32  (1 unrouted)
  Route2 0.305: X1.C32 73.66,25.53 74.93,24.26 78.74,24.26 80.01,25.53 | X2.C32 134.62,25.53 135.89,24.26 139.7,24.26 140.97,25.53 X3.C32 195.58,25.53 196.85,24.26 200.66,24.26 201.93,25.53 X4.C32 256.54,25.53 257.81,24.26 261.62,24.26 262.89,25.53 X5.C32 317.5,25.53 318.77,24.26 324.49,24.26 325.12,24.89 X6.C32 378.46,25.53 380.37,23.62 384.81,23.62 386.08,24.89 X7.C32
CLK_0  (via drill 0.38)
  Route15 0.305: v68.58,69.98 v68.58,73.79
  Bottom 0.305: X9.A27 405.13,38.23 403.86,39.5 394.97,39.5 387.35,31.88 71.12,31.88 68.58,34.42 v68.58,69.98 | 30.69,78.87 U1.16 67.28,78.89 68.58,77.6 v68.58,73.79
CLK_1  (via drill 0.38)
  Route15 0.305: v132.08,69.98 v132.08,73.79
  Bottom 0.305: X9.A22 405.13,50.93 403.86,52.2 397.51,52.2 387.35,42.04 133.35,42.04 132.08,43.31 v132.08,69.98 | U2.16 91.65,78.87 128.91,78.87 132.08,75.69 v132.08,73.79
CLK_2  (via drill 0.38)
  Route15 0.305: v193.04,69.98 v193.04,73.79
  Bottom 0.305: X9.A20 405.13,56.01 403.86,57.28 392.43,57.28 387.35,52.2 194.31,52.2 193.04,53.47 v193.04,69.98 | v193.04,73.79 193.04,77.6 191.75,78.89 U3.16
CLK_3  (via drill 0.38)
  Route15 0.305: v254,69.98 v254,73.79
  Bottom 0.305: X9.A18 405.13,61.09 403.86,62.36 255.27,62.36 254,63.63 v254,69.98 | U4.16 250.8,78.89 254,75.69 v254,73.79
CLK_4  (via drill 0.38)
  Route15 0.305: v288.93,73.79 314.96,73.79 316.23,72.52 414.65,72.52 415.93,73.79 v415.93,76.33
  Bottom 0.305: U5.16 283.82,78.89 v288.93,73.79 | v415.93,76.33 X9.A12
CLK_5  (via drill 0.38)
  Route15 0.305: v366.39,79.5 366.39,87.12 369.57,90.3 v410.85,90.3
  Bottom 0.305: U6.16 365.79,78.89 v366.39,79.5 | v410.85,90.3 408.31,87.76 402.59,87.76 X9.C8
CLK_6
  Bottom 0.305: X9.C10 400.69,81.41 398.14,78.87 396.45,78.87 U7.16
CS_0  (via drill 0.38)
  Route15 0.305: v66.04,69.98 v66.04,73.79
  Bottom 0.305: X9.C27 396.24,38.23 387.35,29.34 71.12,29.34 66.04,34.42 v66.04,69.98 | v66.04,73.79 66.04,75.06 63.5,77.6 34.29,77.6 33.65,78.24 U1.17
CS_1  (via drill 0.38)
  Route15 0.305: v129.54,69.98 v129.54,73.79
  Bottom 0.305: X9.C22 398.78,50.93 387.35,39.5 133.35,39.5 129.54,43.31 v129.54,69.98 | v129.54,73.79 129.54,76.33 128.27,77.6 95.25,77.6 94.61,78.24 U2.17
CS_2  (via drill 0.38)
  Route15 0.305: v190.5,69.98 v190.5,73.79
  Bottom 0.305: X9.C20 393.7,56.01 387.35,49.66 194.31,49.66 190.5,53.47 v190.5,69.98 | U3.17 155.56,78.24 156.21,77.6 189.23,77.6 190.5,76.33 v190.5,73.79
CS_3  (via drill 0.38)
  Route15 0.305: v251.46,69.98 v251.46,73.79
  Bottom 0.305: X9.C18 388.62,61.09 387.35,59.82 255.27,59.82 251.46,63.63 v251.46,69.98 | v251.46,73.79 251.46,76.33 250.19,77.6 217.17,77.6 216.53,78.24 U4.17
CS_4  (via drill 0.38)
  Route15 0.305: v284.48,75.69 314.32,75.69 314.96,75.06 v411.48,75.06
  Bottom 0.305: U5.17 281.93,78.24 v284.48,75.69 | v411.48,75.06 402.59,75.06 X9.C12
CS_5  (via drill 0.38)
  Route15 0.305: v368.3,78.87 368.3,85.22 370.84,87.76 v410.85,87.76
  Bottom 0.305: U6.17 367.68,78.24 v368.3,78.87 | v410.85,87.76 410.85,87.12 410.21,86.49 X9.A8
CS_6
  Bottom 0.305: X9.A10 405.13,81.41 403.86,80.14 400.69,80.14 398.78,78.23 398.77,78.24 U7.17
DGND  (43 unrouted)
GND  (via drill 1)  (1 unrouted)
  Bottom 1.27: v340.36,12.83 337.95,12.83 C3.+ 335.41,12.96 v335.28,12.83 | v366.39,12.83 368.17,12.83 arc90 C2.- 370.71,12.96 arc-90 v370.84,12.83
  pour Route15 (isolate 0.508, rank 2): 1.27,128.4 424.81,128.4 424.81,2.03 1.27,2.03
  pour Route14 (isolate 0.508, rank 2): 1.27,128.4 424.81,128.4 424.81,2.03 1.27,2.03
  pour Route3 (isolate 0.508, rank 2): 1.27,128.4 424.81,128.4 424.81,2.03 1.27,2.03
  pour Top (isolate 0.508, rank 2): 1.27,128.4 424.81,128.4 424.81,2.03 1.27,2.03
MISO_0  (via drill 0.38)
  Route15 0.305: v60.96,69.98 v60.96,73.79
  Bottom 0.305: X9.C28 398.78,35.69 387.35,24.26 71.12,24.26 60.96,34.42 v60.96,69.98 | v60.96,73.79 59.69,75.06 34.29,75.06 33.05,76.29 U1.20
MISO_1  (via drill 0.38)
  Route15 0.305: v124.46,69.98 v124.46,73.79
  Bottom 0.305: X9.C23 387.35,34.42 133.35,34.42 124.46,43.31 v124.46,69.98 | U2.20 94.02,76.29 95.25,75.06 123.19,75.06 v124.46,73.79
MISO_2  (via drill 0.38)
  Route15 0.305: v185.42,69.98 v185.42,73.79
  Bottom 0.305: X9.C21 396.24,53.47 387.35,44.58 194.31,44.58 185.42,53.47 v185.42,69.98 | v185.42,73.79 184.15,75.06 156.21,75.06 154.97,76.29 U3.20
MISO_3  (via drill 0.38)
  Route15 0.305: v246.38,69.98 v246.38,73.79
  Bottom 0.305: X9.C19 391.16,58.55 387.35,54.74 255.27,54.74 246.38,63.63 v246.38,69.98 | v246.38,73.79 245.11,75.06 217.17,75.06 215.94,76.29 U4.20
MISO_4  (via drill 0.38)
  Route15 0.305: v278.76,73.79 278.76,71.88 283.21,67.44 v412.12,67.44
  Bottom 0.305: U5.20 278.76,76.29 v278.76,73.79 | X9.C13 403.86,73.79 405.13,72.52 410.85,72.52 412.12,71.25 v412.12,67.44
MISO_5  (via drill 0.38)
  Route15 0.305: v373.38,77.6 410.21,77.6 412.12,79.5 v412.12,82.68
  Bottom 0.305: U6.20 372.07,76.29 v373.38,77.6 | X9.C9 401.32,83.31 401.95,82.68 v412.12,82.68
MISO_6
  Bottom 0.305: X9.A11 403.86,78.87 402.59,77.6 400.69,77.6 399.42,76.33 398.78,76.33 398.75,76.29 U7.20
MOSI_0  (via drill 0.38)
  Route15 0.305: v63.5,73.79 v63.5,69.98
  Bottom 0.305: X9.A28 405.13,35.69 403.86,36.96 397.51,36.96 387.35,26.8 71.12,26.8 63.5,34.42 v63.5,69.98 | U1.18 33.02,77.6 34.29,76.33 62.23,76.33 63.5,75.06 v63.5,73.79
MOSI_1  (via drill 0.38)
  Route15 0.305: v127,69.98 v127,73.79
  Bottom 0.305: X9.A23 405.13,48.39 403.86,49.66 400.05,49.66 387.35,36.96 133.35,36.96 127,43.31 v127,69.98 | v127,73.79 127,75.06 125.73,76.33 95.25,76.33 93.98,77.59 U2.18
MOSI_2  (via drill 0.38)
  Route15 0.305: v187.96,69.98 v187.96,73.79
  Bottom 0.305: X9.A21 405.13,53.47 403.86,54.74 394.97,54.74 387.35,47.12 194.31,47.12 187.96,53.47 v187.96,69.98 | v187.96,73.79 187.96,75.06 186.69,76.33 156.21,76.33 154.94,77.59 U3.18
MOSI_3  (via drill 0.38)
  Route15 0.305: v248.92,69.98 v248.92,73.79
  Bottom 0.305: X9.A19 405.13,58.55 403.86,59.82 389.89,59.82 387.35,57.28 255.27,57.28 248.92,63.63 v248.92,69.98 | v248.92,73.79 248.92,75.06 247.65,76.33 217.17,76.33 215.91,77.59 U4.18
MOSI_4  (via drill 0.38)
  Route15 0.305: v282.57,73.79 282.57,72.52 285.12,69.98 v415.29,69.98
  Bottom 0.305: U5.18 278.77,77.59 v282.57,73.79 | X9.A13 413.38,73.79 415.29,71.88 v415.29,69.98
MOSI_5  (via drill 0.38)
  Route15 0.305: v370.2,77.6 370.2,82.68 372.75,85.22 v410.85,85.22
  Bottom 0.305: U6.18 v370.2,77.59 | v410.85,85.22 410.85,84.58 410.21,83.95 X9.A9
  Bottom 0.406: v370.2,77.59 v370.2,77.6
MOSI_6
  Bottom 0.305: U7.18 399.41,77.59 400.69,78.87 X9.C11
N$1
  Bottom 0.305: X1.A10 17.78,81.41 19.05,82.68 21.59,82.68 22.77,81.49 U1.9
N$2
  Bottom 0.305: X1.C10 21.59,81.41 22.16,80.84 U1.8
N$3
  Bottom 0.305: X1.A11 17.78,78.87 19.05,80.14 21.59,80.14 21.64,80.19 U1.7
N$4
  Bottom 0.305: X1.C11 21.59,78.87 22.27,79.54 U1.6
N$5
  Bottom 0.305: X1.A12 17.78,76.33 19.05,77.6 21.59,77.6 22.89,78.89 U1.5
N$6
  Bottom 0.305: X1.C12 21.59,76.33 23.5,78.24 U1.4
N$7
  Bottom 0.305: X1.A13 17.78,73.79 19.05,75.06 21.59,75.06 24.12,77.59 U1.3
N$8
  Bottom 0.305: X1.C13 21.59,73.79 24.09,76.29 U1.1
N$9
  Bottom 0.305: U1.19 29.7,76.94 29.34,76.58 C4.P$1 | R5.P$1 29.32,75.31 C4.P$1 | C4.P$1 R4.P$1
N$10
  Bottom 0.305: X2.A10 78.74,81.41 80.01,82.68 82.55,82.68 83.73,81.49 U2.9
N$11
  Bottom 0.305: X2.C10 81.84,80.84 U2.8
N$12
  Bottom 0.305: X2.A11 78.74,78.87 80.01,80.14 82.55,80.14 82.61,80.19 U2.7
N$13
  Bottom 0.305: X2.C11 82.55,78.87 83.22,79.54 U2.6
N$14
  Bottom 0.305: X2.A12 78.74,76.33 80.01,77.6 82.55,77.6 83.84,78.89 U2.5
N$15
  Bottom 0.305: X2.C12 82.55,76.33 84.47,78.24 U2.4
N$16
  Bottom 0.305: X2.A13 78.74,73.79 80.01,75.06 82.55,75.06 85.08,77.59 U2.3
N$17
  Bottom 0.305: X2.C13 82.55,73.79 85.06,76.29 U2.1
N$18
  Bottom 0.305: U2.19 90.66,76.94 90.3,76.58 C6.P$1 | R8.P$1 90.28,75.31 C6.P$1 | C6.P$1 R7.P$1 91.82,73.79
N$19
  Bottom 0.305: X3.A10 139.7,81.41 140.97,82.68 143.51,82.68 144.69,81.49 U3.9
N$20
  Bottom 0.305: X3.C10 143.51,81.41 144.07,80.84 U3.8
N$21
  Bottom 0.305: X3.A11 139.7,78.87 140.97,80.14 143.51,80.14 143.56,80.19 U3.7
N$22
  Bottom 0.305: X3.C11 143.51,78.87 144.19,79.54 U3.6
N$23
  Bottom 0.305: X3.A12 139.7,76.33 140.97,77.6 143.51,77.6 144.81,78.89 U3.5
N$24
  Bottom 0.305: X3.C12 143.51,76.33 145.43,78.24 U3.4
N$25
  Bottom 0.305: X3.A13 139.7,73.79 140.97,75.06 143.51,75.06 146.04,77.59 U3.3
N$26
  Bottom 0.305: X3.C13 143.51,73.79 146.01,76.29 U3.1
N$27
  Bottom 0.305: U3.19 151.62,76.94 151.26,76.58 C8.P$1 | R11.P$1 151.25,75.31 C8.P$1 | C8.P$1 R10.P$1
N$28
  Bottom 0.305: X4.A10 200.66,81.41 201.93,82.68 204.47,82.68 205.66,81.49 U4.9
N$29
  Bottom 0.305: X4.C10 204.47,81.41 205.03,80.84 U4.8
N$30
  Bottom 0.305: X4.A11 200.66,78.87 201.93,80.14 204.47,80.14 204.53,80.19 U4.7
N$31
  Bottom 0.305: X4.C11 204.47,78.87 205.15,79.54 U4.6
N$32
  Bottom 0.305: X4.A12 200.66,76.33 201.93,77.6 204.47,77.6 205.76,78.89 U4.5
N$33
  Bottom 0.305: X4.C12 204.47,76.33 206.38,78.24 U4.4
N$34
  Bottom 0.305: X4.A13 200.66,73.79 201.93,75.06 204.47,75.06 207,77.59 U4.3
N$35
  Bottom 0.305: X4.C13 204.47,73.79 206.97,76.29 U4.1
N$36
  Bottom 0.305: U4.19 212.58,76.94 212.22,76.58 C10.P$1 | R14.P$1 212.21,75.31 C10.P$1 | C10.P$1 R13.P$1
N$37
  Bottom 0.305: X5.A10 261.62,81.41 262.89,82.68 265.43,82.68 266.62,81.49 U5.9
N$38
  Bottom 0.305: X5.C10 265.43,81.41 266,80.84 U5.8
N$39
  Bottom 0.305: X5.A11 261.62,78.87 262.89,80.14 265.43,80.14 265.49,80.19 U5.7
N$40
  Bottom 0.305: X5.C11 265.43,78.87 266.11,79.54 U5.6
N$41
  Bottom 0.305: X5.A12 261.62,76.33 262.89,77.6 265.43,77.6 266.73,78.89 U5.5
N$42
  Bottom 0.305: X5.C12 265.43,76.33 267.35,78.24 U5.4
N$43
  Bottom 0.305: X5.A13 261.62,73.79 262.89,75.06 265.43,75.06 267.96,77.59 U5.3
N$44
  Bottom 0.305: X5.C13 265.43,73.79 267.94,76.29 U5.1
N$45
  Bottom 0.305: U5.19 273.54,76.94 273.18,76.58 C12.P$1 | R17.P$1 273.17,75.31 C12.P$1 | C12.P$1 R16.P$1
N$46
  Bottom 0.305: X6.A10 322.58,81.41 323.85,82.68 326.39,82.68 327.57,81.49 U6.9
N$47
  Bottom 0.305: X6.C10 326.39,81.41 326.95,80.84 U6.8
N$48
  Bottom 0.305: X6.A11 322.58,78.87 323.85,80.14 326.39,80.14 326.44,80.19 U6.7
N$49
  Bottom 0.305: X6.C11 326.39,78.87 327.06,79.54 U6.6
N$50
  Bottom 0.305: X6.A12 322.58,76.33 323.85,77.6 326.39,77.6 327.69,78.89 U6.5
N$51
  Bottom 0.305: X6.C12 326.39,76.33 328.31,78.24 U6.4
N$52
  Bottom 0.305: X6.A13 322.58,73.79 323.85,75.06 326.39,75.06 328.93,77.59 U6.3
N$53
  Bottom 0.305: X6.C13 326.39,73.79 328.89,76.29 U6.1
N$54
  Bottom 0.305: U6.19 334.5,76.94 334.14,76.58 C14.P$1 | R20.P$1 334.12,75.31 C14.P$1 | C14.P$1 R19.P$1
N$55
  Bottom 0.305: X7.A10 383.54,81.41 384.81,82.68 387.35,82.68 388.54,81.49 U7.9
N$56
  Bottom 0.305: X7.C10 387.35,81.41 387.92,80.84 U7.8
N$57
  Bottom 0.305: X7.A11 383.54,78.87 384.81,80.14 387.35,80.14 387.4,80.19 U7.7
N$58
  Bottom 0.305: X7.C11 387.35,78.87 388.02,79.54 U7.6
N$59
  Bottom 0.305: X7.A12 383.54,76.33 384.81,77.6 387.35,77.6 388.64,78.89 U7.5
N$60
  Bottom 0.305: X7.C12 387.35,76.33 389.26,78.24 U7.4
N$61
  Bottom 0.305: X7.A13 383.54,73.79 384.81,75.06 387.35,75.06 389.88,77.59 U7.3
N$62
  Bottom 0.305: X7.C13 387.35,73.79 389.86,76.29 U7.1
N$63
  Bottom 0.305: U7.19 395.46,76.94 395.1,76.58 C16.P$1 | R23.P$1 395.08,75.31 C16.P$1 | C16.P$1 R22.P$1
OE_0
  Bottom 0.305: R3.P$2 24.83,83.64 U1.10
OE_1
  Bottom 0.305: R6.P$2 85.79,83.64 U2.10
OE_2
  Bottom 0.305: R9.P$2 146.75,83.64 U3.10
OE_3
  Bottom 0.305: R12.P$2 207.71,83.64 U4.10
OE_4
  Bottom 0.305: R15.P$2 268.67,83.64 U5.10
OE_5
  Bottom 0.305: R18.P$2 329.63,83.64 U6.10
OE_6
  Bottom 0.305: R21.P$2 390.59,83.64 U7.10
VREF
  Bottom 0.305: X9.C32 X9.A32

## Text on the board
tPlace: v1.0 | Eurocard Backplane | ADD QR CODE | MOD1 | MOD8_AUX | MOD2 | MOD9_AUX | MOD3 | MOD4 | MOD5 | MOD6 | MOD7
bPlace: v1.0 | Eurocard Backplane | short | short | short | short | short | short | short | MOD10_AUX